# Altium schematic sheet DE-010824_02.SchDoc: eDoor_Motherboard
size A3; Author: eldar6776@hotmail.com; DrawnBy: Eldar Dedic; Organization: JUBERA d.o.o.; Address1: Braće Mulić 81; Address2: 71000 Sarajevo; Address3: Federacija BiH; Address4: Bosna i Hercegovina; DocumentNumber: DE-010824; Revision: 001; SheetNumber: 1; SheetTotal: 2
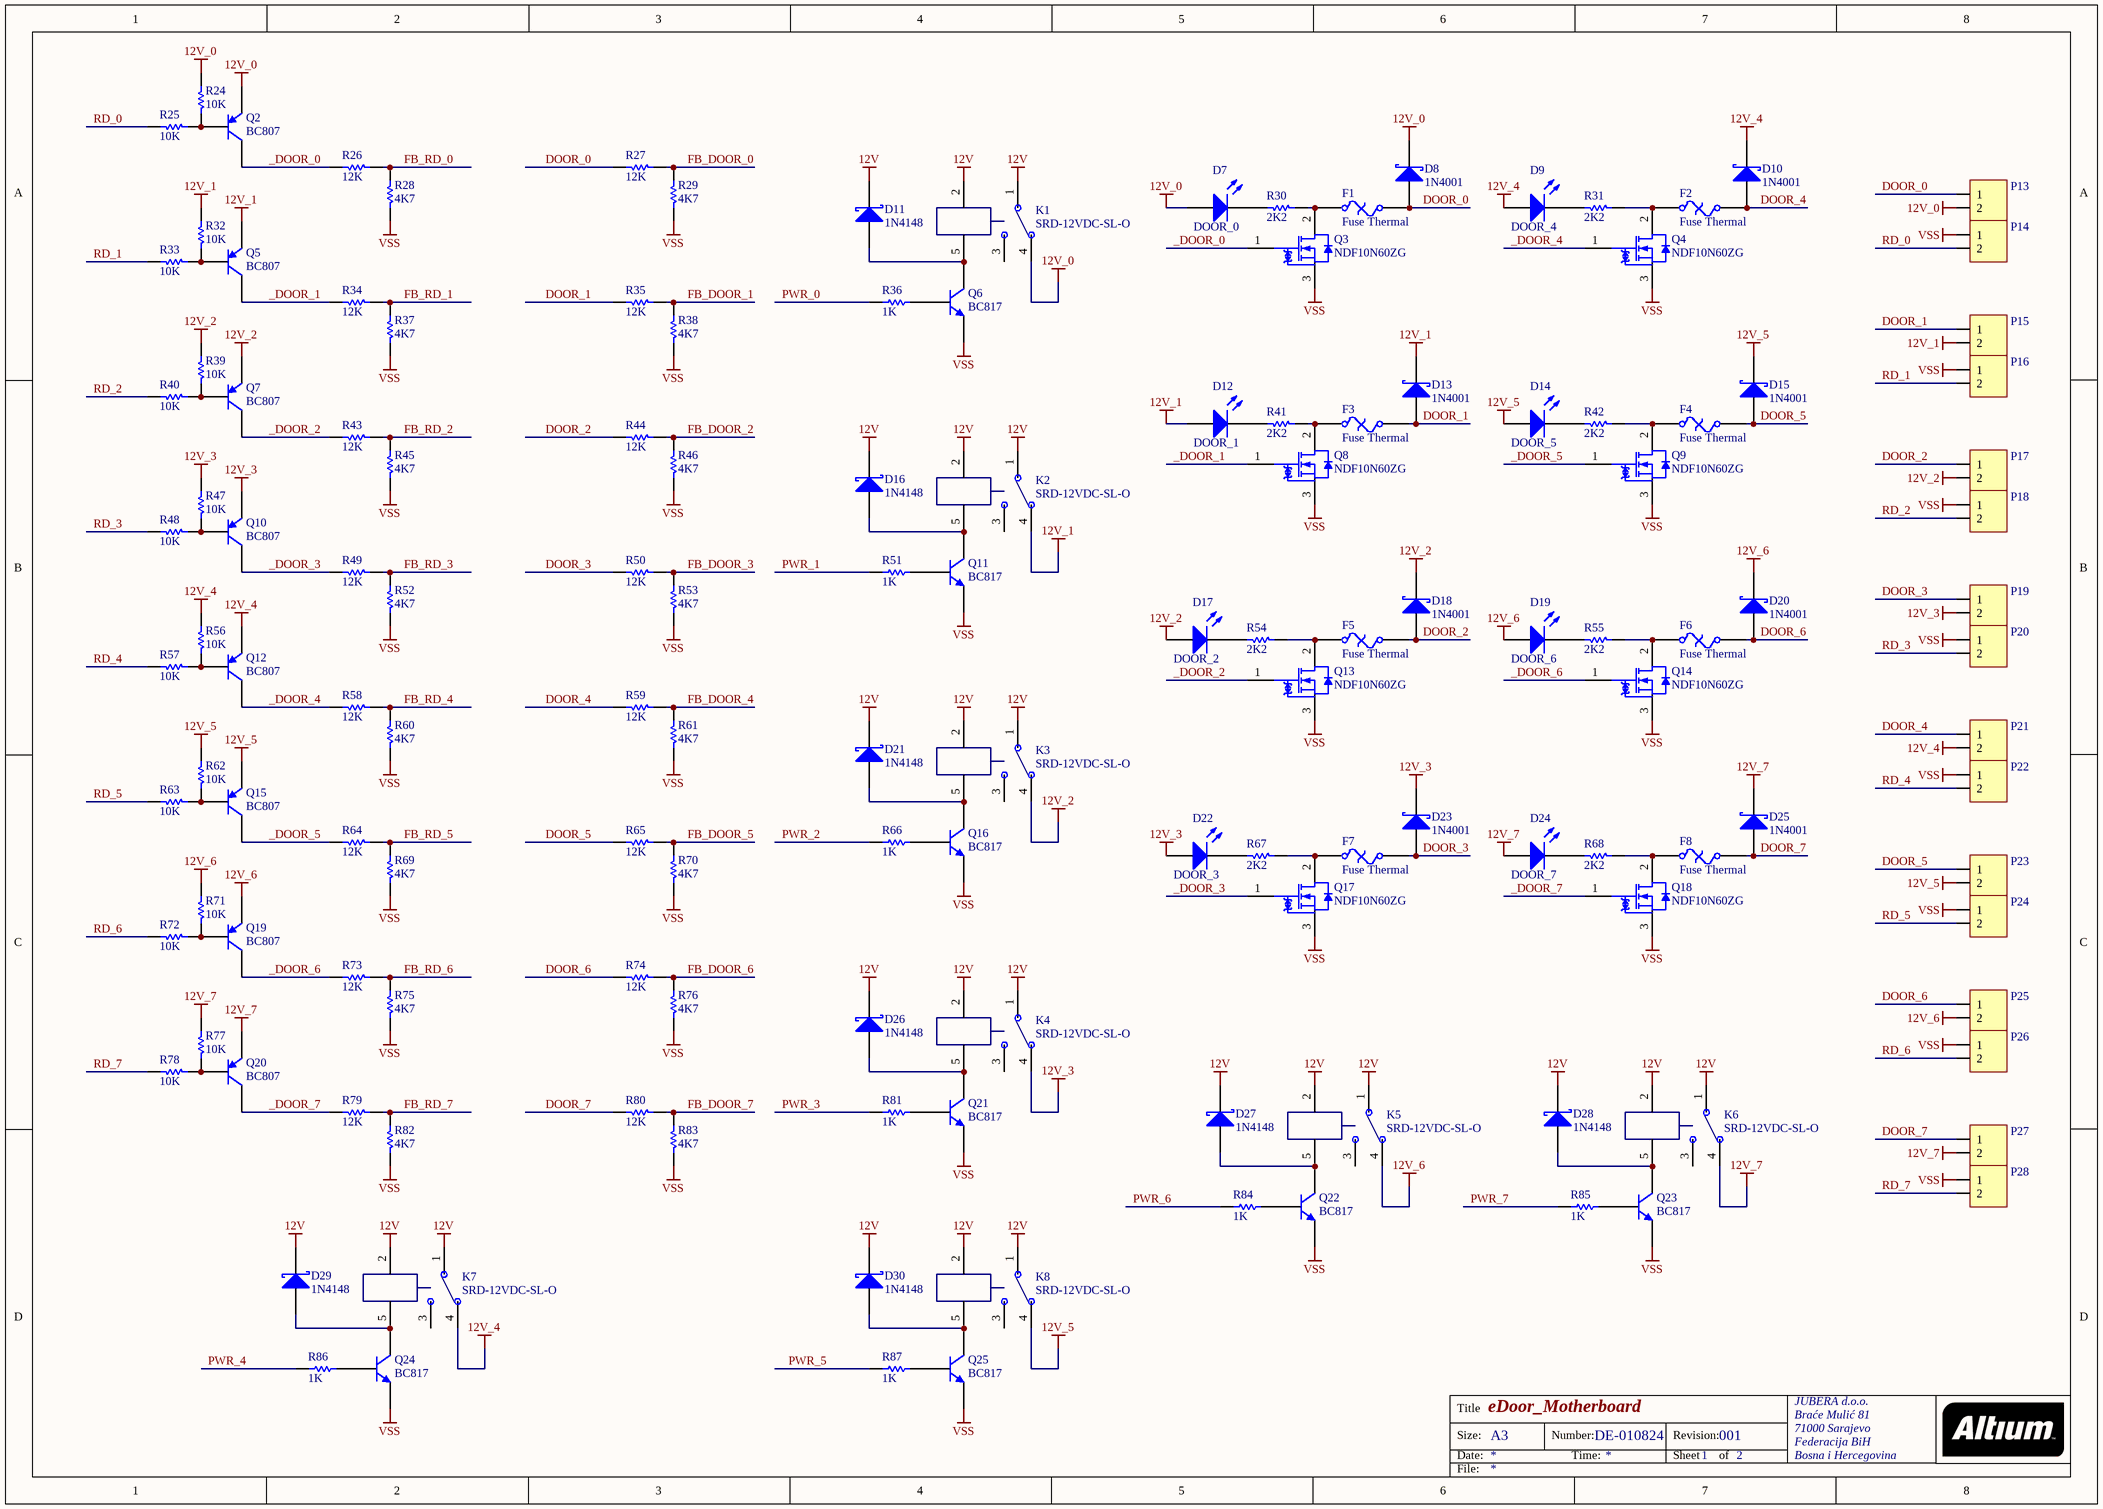
[diagram p0: DE-010824_02.SchDoc]

## Parts
D7  DOOR_0  [1.6X0.8X0.8]
D8  1N4001  [SMB]
D9  DOOR_4  [1.6X0.8X0.8]
D10  1N4001  [SMB]
D11  1N4148  [SOD323]
D12  DOOR_1  [1.6X0.8X0.8]
D13  1N4001  [SMB]
D14  DOOR_5  [1.6X0.8X0.8]
D15  1N4001  [SMB]
D16  1N4148  [SOD323]
D17  DOOR_2  [1.6X0.8X0.8]
D18  1N4001  [SMB]
D19  DOOR_6  [1.6X0.8X0.8]
D20  1N4001  [SMB]
D21  1N4148  [SOD323]
D22  DOOR_3  [1.6X0.8X0.8]
D23  1N4001  [SMB]
D24  DOOR_7  [1.6X0.8X0.8]
D25  1N4001  [SMB]
D26  1N4148  [SOD323]
D27  1N4148  [SOD323]
D28  1N4148  [SOD323]
D29  1N4148  [SOD323]
D30  1N4148  [SOD323]
F1  Fuse Thermal  [PIN-W2/E2.8]
F2  Fuse Thermal  [PIN-W2/E2.8]
F3  Fuse Thermal  [PIN-W2/E2.8]
F4  Fuse Thermal  [PIN-W2/E2.8]
F5  Fuse Thermal  [PIN-W2/E2.8]
F6  Fuse Thermal  [PIN-W2/E2.8]
F7  Fuse Thermal  [PIN-W2/E2.8]
F8  Fuse Thermal  [PIN-W2/E2.8]
K1  SRD-12VDC-SL-O  [SRD-12VDC-SL-O]
K2  SRD-12VDC-SL-O  [SRD-12VDC-SL-O]
K3  SRD-12VDC-SL-O  [SRD-12VDC-SL-O]
K4  SRD-12VDC-SL-O  [SRD-12VDC-SL-O]
K5  SRD-12VDC-SL-O  [SRD-12VDC-SL-O]
K6  SRD-12VDC-SL-O  [SRD-12VDC-SL-O]
K7  SRD-12VDC-SL-O  [SRD-12VDC-SL-O]
K8  SRD-12VDC-SL-O  [SRD-12VDC-SL-O]
P13  DOOR_0  [TERMINAL BLOK 2]  (value not drawn)
P14  GND  [TERMINAL BLOK 2]  (value not drawn)
P15  DOOR_0  [TERMINAL BLOK 2]  (value not drawn)
P16  GND  [TERMINAL BLOK 2]  (value not drawn)
P17  DOOR_0  [TERMINAL BLOK 2]  (value not drawn)
P18  GND  [TERMINAL BLOK 2]  (value not drawn)
P19  DOOR_0  [TERMINAL BLOK 2]  (value not drawn)
P20  GND  [TERMINAL BLOK 2]  (value not drawn)
P21  DOOR_0  [TERMINAL BLOK 2]  (value not drawn)
P22  GND  [TERMINAL BLOK 2]  (value not drawn)
P23  DOOR_0  [TERMINAL BLOK 2]  (value not drawn)
P24  GND  [TERMINAL BLOK 2]  (value not drawn)
P25  DOOR_0  [TERMINAL BLOK 2]  (value not drawn)
P26  GND  [TERMINAL BLOK 2]  (value not drawn)
P27  DOOR_0  [TERMINAL BLOK 2]  (value not drawn)
P28  GND  [TERMINAL BLOK 2]  (value not drawn)
Q2  BC807  [SOT23_N]
Q3  NDF10N60ZG  [ONSC-TO-220-3-221D-03]
Q4  NDF10N60ZG  [ONSC-TO-220-3-221D-03]
Q5  BC807  [SOT23_N]
Q6  BC817  [SOT23_N]
Q7  BC807  [SOT23_N]
Q8  NDF10N60ZG  [ONSC-TO-220-3-221D-03]
Q9  NDF10N60ZG  [ONSC-TO-220-3-221D-03]
Q10  BC807  [SOT23_N]
Q11  BC817  [SOT23_N]
Q12  BC807  [SOT23_N]
Q13  NDF10N60ZG  [ONSC-TO-220-3-221D-03]
Q14  NDF10N60ZG  [ONSC-TO-220-3-221D-03]
Q15  BC807  [SOT23_N]
Q16  BC817  [SOT23_N]
Q17  NDF10N60ZG  [ONSC-TO-220-3-221D-03]
Q18  NDF10N60ZG  [ONSC-TO-220-3-221D-03]
Q19  BC807  [SOT23_N]
Q20  BC807  [SOT23_N]
Q21  BC817  [SOT23_N]
Q22  BC817  [SOT23_N]
Q23  BC817  [SOT23_N]
Q24  BC817  [SOT23_N]
Q25  BC817  [SOT23_N]
R24  10K  [ERA-0603]
R25  10K  [ERA-0603]
R26  12K  [ERA-0603]
R27  12K  [ERA-0603]
R28  4K7  [ERA-0603]
R29  4K7  [ERA-0603]
R30  2K2  [ERA-0603]
R31  2K2  [ERA-0603]
R32  10K  [ERA-0603]
R33  10K  [ERA-0603]
R34  12K  [ERA-0603]
R35  12K  [ERA-0603]
R36  1K  [ERA-0603]
R37  4K7  [ERA-0603]
R38  4K7  [ERA-0603]
R39  10K  [ERA-0603]
R40  10K  [ERA-0603]
R41  2K2  [ERA-0603]
R42  2K2  [ERA-0603]
R43  12K  [ERA-0603]
R44  12K  [ERA-0603]
R45  4K7  [ERA-0603]
R46  4K7  [ERA-0603]
R47  10K  [ERA-0603]
R48  10K  [ERA-0603]
R49  12K  [ERA-0603]
R50  12K  [ERA-0603]
R51  1K  [ERA-0603]
R52  4K7  [ERA-0603]
R53  4K7  [ERA-0603]
R54  2K2  [ERA-0603]
R55  2K2  [ERA-0603]
R56  10K  [ERA-0603]
R57  10K  [ERA-0603]
R58  12K  [ERA-0603]
R59  12K  [ERA-0603]
R60  4K7  [ERA-0603]
R61  4K7  [ERA-0603]
R62  10K  [ERA-0603]
R63  10K  [ERA-0603]
R64  12K  [ERA-0603]
R65  12K  [ERA-0603]
R66  1K  [ERA-0603]
R67  2K2  [ERA-0603]
R68  2K2  [ERA-0603]
R69  4K7  [ERA-0603]
R70  4K7  [ERA-0603]
R71  10K  [ERA-0603]
R72  10K  [ERA-0603]
R73  12K  [ERA-0603]
R74  12K  [ERA-0603]
R75  4K7  [ERA-0603]
R76  4K7  [ERA-0603]
R77  10K  [ERA-0603]
R78  10K  [ERA-0603]
R79  12K  [ERA-0603]
R80  12K  [ERA-0603]
R81  1K  [ERA-0603]
R82  4K7  [ERA-0603]
R83  4K7  [ERA-0603]
R84  1K  [ERA-0603]
R85  1K  [ERA-0603]
R86  1K  [ERA-0603]
R87  1K  [ERA-0603]

## Nets
12V: D11.1(K) D16.1(K) D21.1(K) D26.1(K) D27.1(K) D28.1(K) D29.1(K) D30.1(K) K1.1 K1.2 K2.1 K2.2 K3.1 K3.2 K4.1 K4.2 K5.1 K5.2 K6.1 K6.2 K7.1 K7.2 K8.1 K8.2
12V_0: D7.1(A) D8.2(K) K1.4 P13.2 Q2.2(E) R24.2
12V_1: D12.1(A) D13.2(K) K2.4 P15.2 Q5.2(E) R32.2
12V_2: D17.1(A) D18.2(K) K3.4 P17.2 Q7.2(E) R39.2
12V_3: D22.1(A) D23.2(K) K4.4 P19.2 Q10.2(E) R47.2
12V_4: D9.1(A) D10.2(K) K7.4 P21.2 Q12.2(E) R56.2
12V_5: D14.1(A) D15.2(K) K8.4 P23.2 Q15.2(E) R62.2
12V_6: D19.1(A) D20.2(K) K5.4 P25.2 Q19.2(E) R71.2
12V_7: D24.1(A) D25.2(K) K6.4 P27.2 Q20.2(E) R77.2
VSS: P14.1 P16.1 P18.1 P20.1 P22.1 P24.1 P26.1 P28.1 Q3.3(S) Q4.3(S) Q6.2(E) Q8.3(S) Q9.3(S) Q11.2(E) Q13.3(S) Q14.3(S) Q16.2(E) Q17.3(S) Q18.3(S) Q21.2(E) Q22.2(E) Q23.2(E) Q24.2(E) Q25.2(E) R28.1 R29.1 R37.1 R38.1 R45.1 R46.1 R52.1 R53.1 R60.1 R61.1 R69.1 R70.1 R75.1 R76.1 R82.1 R83.1
_DOOR_0: Q2.3(C) Q3.1(G) R26.1
_DOOR_1: Q5.3(C) Q8.1(G) R34.1
_DOOR_2: Q7.3(C) Q13.1(G) R43.1
_DOOR_3: Q10.3(C) Q17.1(G) R49.1
_DOOR_4: Q4.1(G) Q12.3(C) R58.1
_DOOR_5: Q9.1(G) Q15.3(C) R64.1
_DOOR_6: Q14.1(G) Q19.3(C) R73.1
_DOOR_7: Q18.1(G) Q20.3(C) R79.1
DOOR_0: D8.1(A) F1.2 P13.1 R27.1
DOOR_1: D13.1(A) F3.2 P15.1 R35.1
DOOR_2: D18.1(A) F5.2 P17.1 R44.1
DOOR_3: D23.1(A) F7.2 P19.1 R50.1
DOOR_4: D10.1(A) F2.2 P21.1 R59.1
DOOR_5: D15.1(A) F4.2 P23.1 R65.1
DOOR_6: D20.1(A) F6.2 P25.1 R74.1
DOOR_7: D25.1(A) F8.2 P27.1 R80.1
FB_DOOR_0: R27.2 R29.2
FB_DOOR_1: R35.2 R38.2
FB_DOOR_2: R44.2 R46.2
FB_DOOR_3: R50.2 R53.2
FB_DOOR_4: R59.2 R61.2
FB_DOOR_5: R65.2 R70.2
FB_DOOR_6: R74.2 R76.2
FB_DOOR_7: R80.2 R83.2
FB_RD_0: R26.2 R28.2
FB_RD_1: R34.2 R37.2
FB_RD_2: R43.2 R45.2
FB_RD_3: R49.2 R52.2
FB_RD_4: R58.2 R60.2
FB_RD_5: R64.2 R69.2
FB_RD_6: R73.2 R75.2
FB_RD_7: R79.2 R82.2
PWR_0: R36.2
PWR_1: R51.2
PWR_2: R66.2
PWR_3: R81.2
PWR_4: R86.2
PWR_5: R87.2
PWR_6: R84.2
PWR_7: R85.2
RD_0: P14.2 R25.1
RD_1: P16.2 R33.1
RD_2: P18.2 R40.1
RD_3: P20.2 R48.1
RD_4: P22.2 R57.1
RD_5: P24.2 R63.1
RD_6: P26.2 R72.1
RD_7: P28.2 R78.1
NetD7_2: D7.2(K) R30.1
NetD9_2: D9.2(K) R31.1
NetD11_2: D11.2(A) K1.5 Q6.3(C)
NetD12_2: D12.2(K) R41.1
NetD14_2: D14.2(K) R42.1
NetD16_2: D16.2(A) K2.5 Q11.3(C)
NetD17_2: D17.2(K) R54.1
NetD19_2: D19.2(K) R55.1
NetD21_2: D21.2(A) K3.5 Q16.3(C)
NetD22_2: D22.2(K) R67.1
NetD24_2: D24.2(K) R68.1
NetD26_2: D26.2(A) K4.5 Q21.3(C)
NetD27_2: D27.2(A) K5.5 Q22.3(C)
NetD28_2: D28.2(A) K6.5 Q23.3(C)
NetD29_2: D29.2(A) K7.5 Q24.3(C)
NetD30_2: D30.2(A) K8.5 Q25.3(C)
NetF1_1: F1.1 Q3.2(D) R30.2
NetF2_1: F2.1 Q4.2(D) R31.2
NetF3_1: F3.1 Q8.2(D) R41.2
NetF4_1: F4.1 Q9.2(D) R42.2
NetF5_1: F5.1 Q13.2(D) R54.2
NetF6_1: F6.1 Q14.2(D) R55.2
NetF7_1: F7.1 Q17.2(D) R67.2
NetF8_1: F8.1 Q18.2(D) R68.2
NetQ2_1: Q2.1(B) R24.1 R25.2
NetQ5_1: Q5.1(B) R32.1 R33.2
NetQ6_1: Q6.1(B) R36.1
NetQ7_1: Q7.1(B) R39.1 R40.2
NetQ10_1: Q10.1(B) R47.1 R48.2
NetQ11_1: Q11.1(B) R51.1
NetQ12_1: Q12.1(B) R56.1 R57.2
NetQ15_1: Q15.1(B) R62.1 R63.2
NetQ16_1: Q16.1(B) R66.1
NetQ19_1: Q19.1(B) R71.1 R72.2
NetQ20_1: Q20.1(B) R77.1 R78.2
NetQ21_1: Q21.1(B) R81.1
NetQ22_1: Q22.1(B) R84.1
NetQ23_1: Q23.1(B) R85.1
NetQ24_1: Q24.1(B) R86.1
NetQ25_1: Q25.1(B) R87.1

Not connected (* = marked no-connect by the designer): K1 3; K2 3; K3 3; K4 3; K5 3; K6 3; K7 3; K8 3

## Notes on the sheet
- Title
- Size:
- Date:
- A3
- Number:
- Time:
- Revision:
- Sheet
- of
- File:

## Library data of the parts
D7 D9 D12 D14 D17 D19 D22 D24 = HSMB-C190: Blue Surface Mount Chip LED, Blue; LuminousIntensity: 1.6mcd (Minimum).; PCB_Layout: Complies with manufacturer's recommendation.; Published: 11-Dec-2002; DatasheetVersion: 26-Feb-2002; PackageVersion: Mar-2002; PackageReference: 1.6X0.8X0.8; Publisher: Altium Limited; PackageDescription: SM LED; 2 Flat Leads; LED_Colour: Blue; ComponentLink1Description: Manufacturer Link; ComponentLink1URL: http://www.avagotech.com/; ComponentLink2Description: Datasheet; ComponentLink2URL: http://cp.literature.agilent.com/litweb/pdf/5988-5211EN.pdf
D8 D10 D13 D15 D18 D20 D23 D25 = D Schottky: Schottky Diode; Published: 8-Jun-2000; LatestRevisionDate: 17-Jul-2002; LatestRevisionNote: Re-released for DXP Platform.; PackageReference: SMB; Publisher: Altium Limited; PackageDescription: DO-214-AA/SMB; 2 C-Bend Leads; Body 5.3 x 3.6 mm, inc. leads (LxW); Code_JEDEC: DO-214-AA
D11 D16 D21 D26-D30 = 1PS76SB10: Schottky Barrier Diode; Published: 17-Sep-2003; LatestRevisionDate: 19-Mar-2004; LatestRevisionNote: Silkscreen size reduced.; DatasheetVersion: 14-Oct-1996; PackageVersion: May-1999; PackageReference: SOD323; Publisher: Altium Limited; PackageDescription: SOD-323/SC-76; 2 Leads; Body 1.7 x 1.3 mm, (LxW); ComponentLink1Description: Manufacturer Link; ComponentLink1URL: http://www.semiconductors.philips.com/; ComponentLink2Description: Datasheet; ComponentLink2URL: http://www.semiconductors.philips.com/acrobat/datasheets/1PS76SB10_2.pdf
F1-F8 = Fuse Thermal: Thermal Fuse; Published: 24-Mar-1999; LatestRevisionDate: 17-Jul-2002; LatestRevisionNote: Re-released for DXP Platform.; PackageReference: PIN-W2/E2.8; Publisher: Altium Limited; PackageDescription: Thru-Hole; 2 Leads
K1-K8 = SRD-12VDC-SL-O: SPDT PCB relay 12Vc coil
P13-P28 = TERMINAL BLOK 2: Terminal blok konektor 3,5 mm
Q2 Q5 Q7 Q10 Q12 Q15 Q19 Q20 = BC807: PNP General-purpose Transistor; Published: 17-Sep-2003; LatestRevisionDate: 12-Dec-2006; LatestRevisionNote: IPC-7351 Footprint Added.; DatasheetVersion: 8-Apr-1999; PackageVersion: May-1999; PackageReference: SOT23; Publisher: Altium Limited; PackageDescription: 3-Pin SOT-23 Package 0.95 mm Pitch, 2.3 mm Lead Span; ComponentLink1Description: Manufacturer Link; ComponentLink1URL: http://www.semiconductors.philips.com/; ComponentLink2Description: Datasheet; ComponentLink2URL: http://www.semiconductors.philips.com/acrobat/datasheets/BC807_BC807W_BC327_5.pdf
Q3 Q4 Q8 Q9 Q13 Q14 Q17 Q18 = NDF10N60ZG: N-Channel Power MOSFET 600 V, 0.75 Ohm, 3-Pin TO-220, Pb-Free, Tube; Manufacturer: On Semiconductor; Channel Polarity: N Channel; Ciss Typ (pF): 1373; Configuration: Single; Coss Typ (pF): 150; Crss Typ (pF): 35; PD Max (W): 39; Qrr Typ (nC): 3000; V(BR)DSS Min (V): 600; VGS Max (V): 30; VGS(th) Max (V): 4.5; DatasheetVersion: Rev. 12; PackageVersion: Rev. K, 02/2009; PackageReference: TO-220-3-221D-03; PackageDescription: 3-Pin Flange Mount, Vertical Straight Lead, Body 10.295 x 4.7 mm, Pitch 2.54 mm; Package Type: TO-220 FULLPAK-3; Packing: Tube; RoHS: Pb-Free; Mounting Technology: Through Hole; PartNumber: NDF10N60ZG; ComponentLink1Description: Manufacturer URL; ComponentLink1URL: http://www.onsemi.com/; ComponentLink2Description: Datasheet; ComponentLink2URL: http://www.onsemi.cn/pub_link/Collateral/NDF10N60Z-D.PDF; ComponentLink3Description: Package Specification; ComponentLink3URL: http://www.onsemi.com/pub_link/Collateral/221D-03.PDF
Q6 Q11 Q16 Q21-Q25 = BC817: NPN General-purpose Transistor; Published: 17-Sep-2003; LatestRevisionDate: 12-Dec-2006; LatestRevisionNote: IPC-7351 Footprint Added.; DatasheetVersion: Jun-1999; PackageVersion: May-1999; PackageReference: SOT23; Publisher: Altium Limited; PackageDescription: 3-Pin SOT-23 Package 0.95 mm Pitch, 2.3 mm Lead Span; ComponentLink1Description: Manufacturer Link; ComponentLink1URL: http://www.semiconductors.philips.com/; ComponentLink2Description: Datasheet; ComponentLink2URL: http://www.semiconductors.philips.com/acrobat/datasheets/BC817_BC817W_BC337_5.pdf
R24-R87 = ERAV: Metal Film Thermosensitive Chip Resistor, 0.56 Ohm to 10k Ohm Range, 5% Tolerance, 0603 Size, 0.063 W; Note: If flow soldering, adjust pad width of PCB Footprint to 0.7 - 0.8 times the width of the resistor.; Published: 17-Dec-2003; LatestRevisionDate: 19-Mar-2004; LatestRevisionNote: Silkscreen size reduced.; PackageDocument: Mar-2003; PackageReference: ERA-0603; Publisher: Altium Limited; Code_IPC: 1608 [0603]; ComponentLink1Description: Manufacturer Link; ComponentLink1URL: http://www.panasonic.com/industrial/components/resistive_products.htm; ComponentLink2Description: Datasheet; ComponentLink2URL: http://www.panasonic.com/industrial/components/pdf/AOF0000CE1.pdf